# Altium schematic sheet 01-MCU.SchDoc
size A4
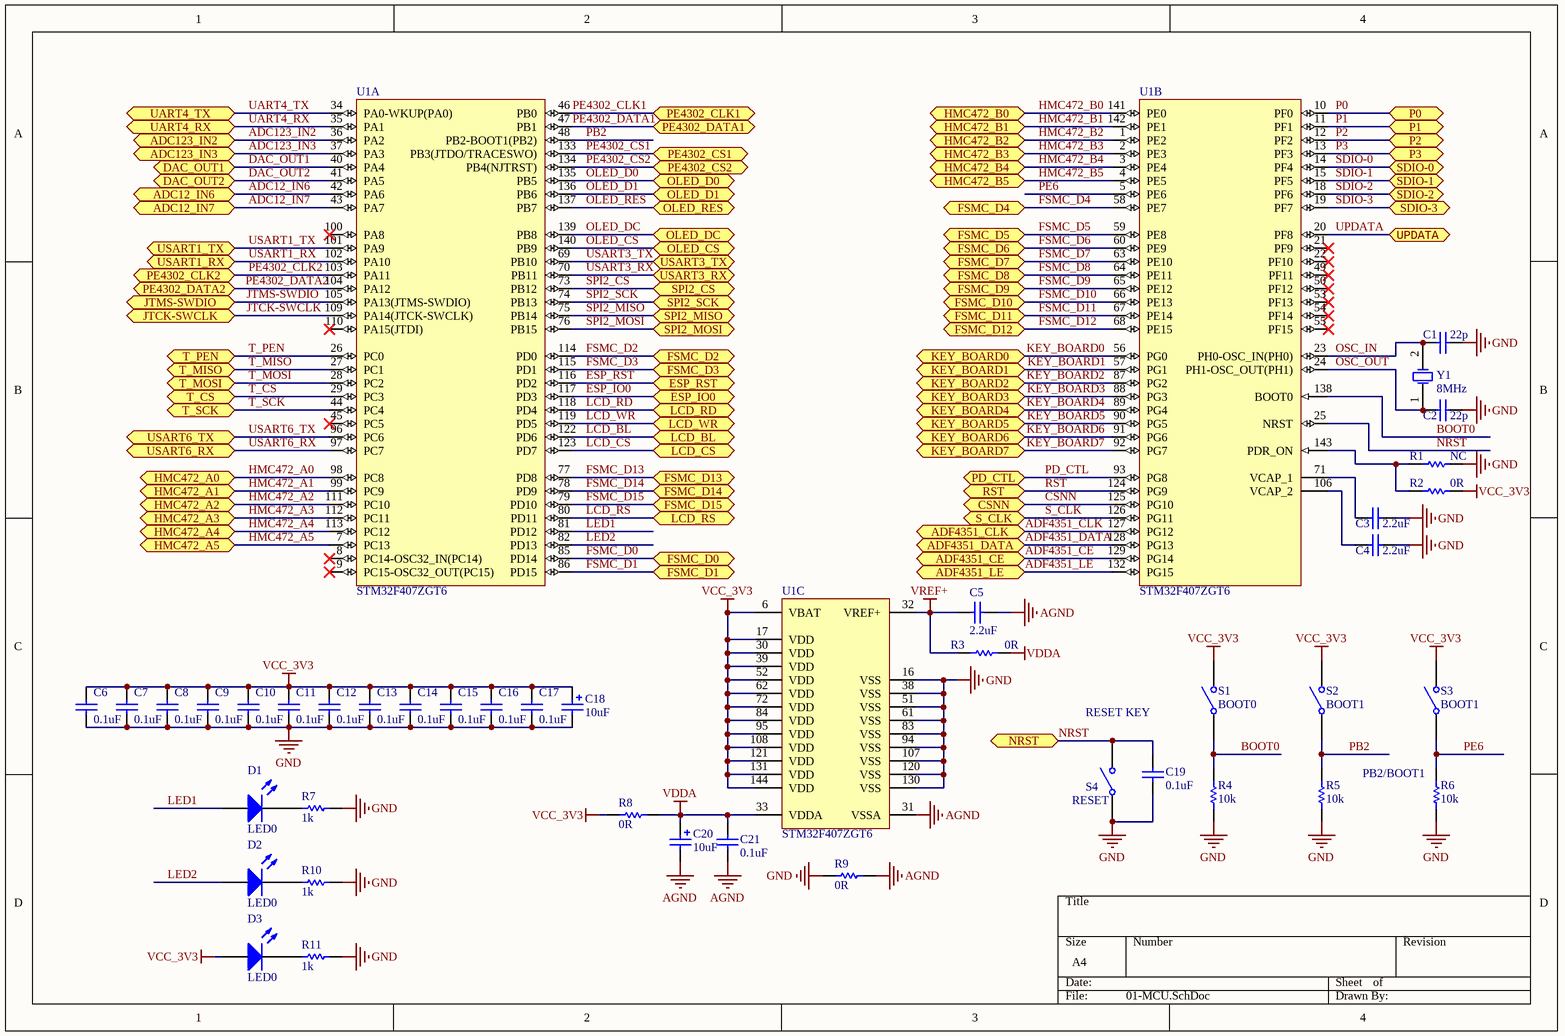
[diagram p0: 01-MCU.SchDoc]

## Parts
C1  22p  [0603C]
C2  22p  [0603C]
C3  2.2uF  [0603C]
C4  2.2uF  [0603C]
C5  2.2uF  [0603C]
C6  0.1uF  [0603C]
C7  0.1uF  [0603C]
C8  0.1uF  [0603C]
C9  0.1uF  [0603C]
C10  0.1uF  [0603C]
C11  0.1uF  [0603C]
C12  0.1uF  [0603C]
C13  0.1uF  [0603C]
C14  0.1uF  [0603C]
C15  0.1uF  [0603C]
C16  0.1uF  [0603C]
C17  0.1uF  [0603C]
C18  10uF  [1206T]
C19  0.1uF  [0603C]
C20  10uF  [1206T]
C21  0.1uF  [0603C]
D1  LED0  [0603D]
D2  LED0  [0603D]
D3  LED0  [0603D]
R1  NC  [0603R]
R2  0R  [0603R]
R3  0R  [0603R]
R4  10k  [0603R]
R5  10k  [0603R]
R6  10k  [0603R]
R7  1k  [0603R]
R8  0R  [0603R]
R9  0R  [0603R]
R10  1k  [0603R]
R11  1k  [0603R]
S1  BOOT0  [micro button_2_SMD]
S2  BOOT1  [micro button_2_SMD]
S3  BOOT1  [micro button_2_SMD]
S4  RESET  [micro button_2_SMD]
U1  STM32F407ZGT6  [QFP144-0r5-20X20]  (parts A,B,C of 3)
Y1  8MHz  [CO2-4R75X11R4-S]

## Ports
ADC12_IN6 (bidir), ADC12_IN7 (bidir), ADC123_IN2 (bidir), ADC123_IN3 (bidir), ADF4351_CE (bidir), ADF4351_CLK (bidir), ADF4351_DATA (bidir), ADF4351_LE (bidir), CSNN (bidir), DAC_OUT1 (bidir), DAC_OUT2 (bidir), ESP_IO0 (bidir), ESP_RST (bidir), FSMC_D0 (bidir), FSMC_D1 (bidir), FSMC_D2 (bidir), FSMC_D3 (bidir), FSMC_D4 (bidir), FSMC_D5 (bidir), FSMC_D6 (bidir), FSMC_D7 (bidir), FSMC_D8 (bidir), FSMC_D9 (bidir), FSMC_D10 (bidir), FSMC_D11 (bidir), FSMC_D12 (bidir), FSMC_D13 (bidir), FSMC_D14 (bidir), FSMC_D15 (bidir), HMC472_A0 (bidir), HMC472_A1 (bidir), HMC472_A2 (bidir), HMC472_A3 (bidir), HMC472_A4 (bidir), HMC472_A5 (bidir), HMC472_B0 (bidir), HMC472_B1 (bidir), HMC472_B2 (bidir), HMC472_B3 (bidir), HMC472_B4 (bidir), HMC472_B5 (bidir), JTCK-SWCLK (bidir), JTMS-SWDIO (bidir), KEY_BOARD0 (bidir), KEY_BOARD1 (bidir), KEY_BOARD2 (bidir), KEY_BOARD3 (bidir), KEY_BOARD4 (bidir), KEY_BOARD5 (bidir), KEY_BOARD6 (bidir), KEY_BOARD7 (bidir), LCD_BL (bidir), LCD_CS (bidir), LCD_RD (bidir), LCD_RS (bidir), LCD_WR (bidir), NRST (bidir), OLED_CS (bidir), OLED_D0 (bidir), OLED_D1 (bidir), OLED_DC (bidir), OLED_RES (bidir), P0 (bidir), P1 (bidir), P2 (bidir), P3 (bidir), PD_CTL (bidir), PE4302_CLK1 (bidir), PE4302_CLK2 (bidir), PE4302_CS1 (bidir), PE4302_CS2 (bidir), PE4302_DATA1 (bidir), PE4302_DATA2 (bidir), RST (bidir), S_CLK (bidir), SDIO-0 (bidir), SDIO-1 (bidir), SDIO-2 (bidir), SDIO-3 (bidir), SPI2_CS (bidir), SPI2_MISO (bidir), SPI2_MOSI (bidir), SPI2_SCK (bidir), T_CS (bidir), T_MISO (bidir), T_MOSI (bidir), T_PEN (bidir), T_SCK (bidir), UART4_RX (bidir), UART4_TX (bidir), UPDATA (bidir), USART1_RX (bidir), USART1_TX (bidir), USART3_RX (bidir), USART3_TX (bidir), USART6_RX (bidir), USART6_TX (bidir)

## Nets
AGND: C5.1 C20.2(-) C21.1 R9.1 U1.31(VSSA)
GND: C1.2 C2.2 C3.2 C4.2 C6.2 C7.2 C8.2 C9.2 C10.2 C11.2 C12.2 C13.2 C14.2 C15.2 C16.2 C17.2 C18.2(-) C19.1 R1.2 R4.1 R5.1 R6.1 R7.2 R9.2 R10.2 R11.2 S4.1(COMMON) U1.16(VSS) U1.38(VSS) U1.51(VSS) U1.61(VSS) U1.83(VSS) U1.94(VSS) U1.107(VSS) U1.120(VSS) U1.130(VSS)
VCC_3V3: C6.1 C7.1 C8.1 C9.1 C10.1 C11.1 C12.1 C13.1 C14.1 C15.1 C16.1 C17.1 C18.1(+) D3.1(A) R2.2 R8.2 S1.2(NO) S2.2(NO) S3.2(NO) U1.6(VBAT) U1.17(VDD) U1.30(VDD) U1.39(VDD) U1.52(VDD) U1.62(VDD) U1.72(VDD) U1.84(VDD) U1.95(VDD) U1.108(VDD) U1.121(VDD) U1.131(VDD) U1.144(VDD)
VDDA: C20.1(+) C21.2 R3.1 R8.1 U1.33(VDDA)
VREF+: C5.2 R3.2 U1.32(VREF+)
ADC12_IN6: U1.42(PA6) ; port ADC12_IN6
ADC12_IN7: U1.43(PA7) ; port ADC12_IN7
ADC123_IN2: U1.36(PA2) ; port ADC123_IN2
ADC123_IN3: U1.37(PA3) ; port ADC123_IN3
ADF4351_CE: U1.129(PG14) ; port ADF4351_CE
ADF4351_CLK: U1.127(PG12) ; port ADF4351_CLK
ADF4351_DATA: U1.128(PG13) ; port ADF4351_DATA
ADF4351_LE: U1.132(PG15) ; port ADF4351_LE
BOOT0: R4.2 S1.1(COMMON) U1.138(BOOT0)
CSNN: U1.125(PG10) ; port CSNN
DAC_OUT1: U1.40(PA4) ; port DAC_OUT1
DAC_OUT2: U1.41(PA5) ; port DAC_OUT2
ESP_IO0: U1.117(PD3) ; port ESP_IO0
ESP_RST: U1.116(PD2) ; port ESP_RST
FSMC_D0: U1.85(PD14) ; port FSMC_D0
FSMC_D1: U1.86(PD15) ; port FSMC_D1
FSMC_D2: U1.114(PD0) ; port FSMC_D2
FSMC_D3: U1.115(PD1) ; port FSMC_D3
FSMC_D4: U1.58(PE7) ; port FSMC_D4
FSMC_D5: U1.59(PE8) ; port FSMC_D5
FSMC_D6: U1.60(PE9) ; port FSMC_D6
FSMC_D7: U1.63(PE10) ; port FSMC_D7
FSMC_D8: U1.64(PE11) ; port FSMC_D8
FSMC_D9: U1.65(PE12) ; port FSMC_D9
FSMC_D10: U1.66(PE13) ; port FSMC_D10
FSMC_D11: U1.67(PE14) ; port FSMC_D11
FSMC_D12: U1.68(PE15) ; port FSMC_D12
FSMC_D13: U1.77(PD8) ; port FSMC_D13
FSMC_D14: U1.78(PD9) ; port FSMC_D14
FSMC_D15: U1.79(PD10) ; port FSMC_D15
HMC472_A0: U1.98(PC8) ; port HMC472_A0
HMC472_A1: U1.99(PC9) ; port HMC472_A1
HMC472_A2: U1.111(PC10) ; port HMC472_A2
HMC472_A3: U1.112(PC11) ; port HMC472_A3
HMC472_A4: U1.113(PC12) ; port HMC472_A4
HMC472_A5: U1.7(PC13) ; port HMC472_A5
HMC472_B0: U1.141(PE0) ; port HMC472_B0
HMC472_B1: U1.142(PE1) ; port HMC472_B1
HMC472_B2: U1.1(PE2) ; port HMC472_B2
HMC472_B3: U1.2(PE3) ; port HMC472_B3
HMC472_B4: U1.3(PE4) ; port HMC472_B4
HMC472_B5: U1.4(PE5) ; port HMC472_B5
JTCK-SWCLK: U1.109(PA14(JTCK-SWCLK)) ; port JTCK-SWCLK
JTMS-SWDIO: U1.105(PA13(JTMS-SWDIO)) ; port JTMS-SWDIO
KEY_BOARD0: U1.56(PG0) ; port KEY_BOARD0
KEY_BOARD1: U1.57(PG1) ; port KEY_BOARD1
KEY_BOARD2: U1.87(PG2) ; port KEY_BOARD2
KEY_BOARD3: U1.88(PG3) ; port KEY_BOARD3
KEY_BOARD4: U1.89(PG4) ; port KEY_BOARD4
KEY_BOARD5: U1.90(PG5) ; port KEY_BOARD5
KEY_BOARD6: U1.91(PG6) ; port KEY_BOARD6
KEY_BOARD7: U1.92(PG7) ; port KEY_BOARD7
LCD_BL: U1.122(PD6) ; port LCD_BL
LCD_CS: U1.123(PD7) ; port LCD_CS
LCD_RD: U1.118(PD4) ; port LCD_RD
LCD_RS: U1.80(PD11) ; port LCD_RS
LCD_WR: U1.119(PD5) ; port LCD_WR
LED1: D1.1(A) U1.81(PD12)
LED2: D2.1(A) U1.82(PD13)
NRST: C19.2 S4.2(NO) U1.25(NRST) ; port NRST
OLED_CS: U1.140(PB9) ; port OLED_CS
OLED_D0: U1.135(PB5) ; port OLED_D0
OLED_D1: U1.136(PB6) ; port OLED_D1
OLED_DC: U1.139(PB8) ; port OLED_DC
OLED_RES: U1.137(PB7) ; port OLED_RES
OSC_IN: C1.1 U1.23(PH0-OSC_IN(PH0)) Y1.2(OSC2)
OSC_OUT: C2.1 U1.24(PH1-OSC_OUT(PH1)) Y1.1(OSC1)
P0: U1.10(PF0) ; port P0
P1: U1.11(PF1) ; port P1
P2: U1.12(PF2) ; port P2
P3: U1.13(PF3) ; port P3
PB2: R5.2 S2.1(COMMON) U1.48(PB2-BOOT1(PB2))
PD_CTL: U1.93(PG8) ; port PD_CTL
PE6: R6.2 S3.1(COMMON) U1.5(PE6)
PE4302_CLK1: U1.46(PB0) ; port PE4302_CLK1
PE4302_CLK2: U1.103(PA11) ; port PE4302_CLK2
PE4302_CS1: U1.133(PB3(JTDO/TRACESWO)) ; port PE4302_CS1
PE4302_CS2: U1.134(PB4(NJTRST)) ; port PE4302_CS2
PE4302_DATA1: U1.47(PB1) ; port PE4302_DATA1
PE4302_DATA2: U1.104(PA12) ; port PE4302_DATA2
RST: U1.124(PG9) ; port RST
S_CLK: U1.126(PG11) ; port S_CLK
SDIO-0: U1.14(PF4) ; port SDIO-0
SDIO-1: U1.15(PF5) ; port SDIO-1
SDIO-2: U1.18(PF6) ; port SDIO-2
SDIO-3: U1.19(PF7) ; port SDIO-3
SPI2_CS: U1.73(PB12) ; port SPI2_CS
SPI2_MISO: U1.75(PB14) ; port SPI2_MISO
SPI2_MOSI: U1.76(PB15) ; port SPI2_MOSI
SPI2_SCK: U1.74(PB13) ; port SPI2_SCK
T_CS: U1.29(PC3) ; port T_CS
T_MISO: U1.27(PC1) ; port T_MISO
T_MOSI: U1.28(PC2) ; port T_MOSI
T_PEN: U1.26(PC0) ; port T_PEN
T_SCK: U1.44(PC4) ; port T_SCK
UART4_RX: U1.35(PA1) ; port UART4_RX
UART4_TX: U1.34(PA0-WKUP(PA0)) ; port UART4_TX
UPDATA: U1.20(PF8) ; port UPDATA
USART1_RX: U1.102(PA10) ; port USART1_RX
USART1_TX: U1.101(PA9) ; port USART1_TX
USART3_RX: U1.70(PB11) ; port USART3_RX
USART3_TX: U1.69(PB10) ; port USART3_TX
USART6_RX: U1.97(PC7) ; port USART6_RX
USART6_TX: U1.96(PC6) ; port USART6_TX
NetC3_1: C3.1 U1.71(VCAP_1)
NetC4_1: C4.1 U1.106(VCAP_2)
NetD1_2: D1.2(K) R7.1
NetD2_2: D2.2(K) R10.1
NetD3_2: D3.2(K) R11.1
NetR1_1: R1.1 R2.1 U1.143(PDR_ON)

Not connected (* = marked no-connect by the designer): U1 8(PC14-OSC32_IN(PC14))* 9(PC15-OSC32_OUT(PC15))* 21(PF9)* 22(PF10)* 45(PC5)* 49(PF11)* 50(PF12)* 53(PF13)* 54(PF14)* 55(PF15)* 100(PA8)* 110(PA15(JTDI))*

## Notes on the sheet
- RESET KEY
- (near R6) PB2/BOOT1

## Library data of the parts
C1-C17 C19 C21 = Cap1: CAP CER 10000PF 100V X7R 0603; Manufacturer: TDK Corporation; Manufacturer Part Number: C1608X7R2A103K080AA; Tolerance: ±10%; Notification: Current market demand for these product types have resulted in fluctuating and extending lead times. Lead times may differ.; Supplier 1: Digi-Key; RoHS: RoHS Compliant; Category: Capacitors; Stock 1: 40000; Pricing 1: 4000=0.01438 (USD); Packaging: Tape & Reel (TR); Part Status: Active; Voltage - Rated: 100V; Temperature Coefficient: X7R; Operating Temperature: -55°C ~ 125°C; Features: -; Ratings: -; Applications: General Purpose; Failure Rate: -; Mounting Type: Surface Mount, MLCC; Package / Case: 0603 (1608 Metric); Size / Dimension: 0.063" L x 0.032" W (1.60mm x 0.80mm); Height - Seated (Max): -; Thickness (Max): 0.035" (0.90mm); Lead Spacing: -; Lead Style: -; ComponentLink1URL: https://product.tdk.com/info/en/catalog/datasheets/mlcc_commercial_midvoltage_en.pdf; ComponentLink1Description: https://product.tdk.com/info/en/catalog/datasheets/mlcc_commercial_midvoltage_en.pdf; Supplier Part Number 1: 445-1304-2-ND
  C1 C2: Value: 22p
  C3-C5: Value: 2.2uF
  C6-C17 C19 C21: Value: 0.1uF
C18 C20 = Cap2: CAP TANT 10UF 10V 10% 1206; Manufacturer: KEMET; Manufacturer Part Number: T491A106K010AT7280; Manufacturer Size Code: A; Type: Molded; ESR (Equivalent Series Resistance): 3.8 Ohm; Lifetime @ Temp.: 2000 Hrs @ 125°C; Notification: Current market demand for these product types have resulted in fluctuating and extending lead times. Lead times may differ.; Supplier 1: Digi-Key; RoHS: RoHS Compliant; Category: Capacitors; Stock 1: 27000; Pricing 1: 9000=0.084, 18000=0.08138, 27000=0.07875, 63000=0.0735 (USD); Packaging: Tape & Reel (TR); Part Status: Active; Tolerance: ±10%; Operating Temperature: -55°C ~ 125°C; Mounting Type: Surface Mount; Package / Case: 1206 (3216 Metric); Size / Dimension: 0.126" L x 0.063" W (3.20mm x 1.60mm); Height - Seated (Max): 0.071" (1.80mm); Lead Spacing: -; Features: General Purpose; Failure Rate: -; ComponentLink1URL: https://api.kemet.com/component-edge/download/datasheet/T491A106K010AT7280.pdf; ComponentLink1Description: https://api.kemet.com/component-edge/download/datasheet/T491A106K010AT7280.pdf; Supplier Part Number 1: 399-8268-2-ND; Value: 10uF
D1-D3 = LED0: Typical INFRARED GaAs LED; pin to pad: 1>2 2>1; Published: 8-Jun-2000; LatestRevisionDate: 08-Jul-2005; LatestRevisionNote: Mech Layer 1 removed.; PackageReference: LED-0; Publisher: Altium Limited; PackageDescription: LED; 2 Leads
R1-R11 = Res1: RES SMD 1K OHM 0.5% 1/16W 0603; Manufacturer: Susumu; Manufacturer Part Number: RR0816P-102-D; Power (Watts): 0.063W, 1/16W; Temperature Coefficient: ±25ppm/°C; Supplier 1: Digi-Key; RoHS: RoHS Compliant; Category: Resistors; Stock 1: 1648842; Pricing 1: 1=0.13, 10=0.122, 100=0.0483, 1000=0.0225, 2500=0.01973 (USD); Packaging: Digi-Reel?; Part Status: Active; Tolerance: ±0.5%; Composition: Thin Film; Features: -; Operating Temperature: -55°C ~ 125°C; Package / Case: 0603 (1608 Metric); Supplier Device Package: -; Size / Dimension: 0.063" L x 0.032" W (1.60mm x 0.80mm); Height - Seated (Max): 0.020" (0.50mm); Failure Rate: -; ComponentLink1URL: http://www.susumu.co.jp/common/pdf/n_catalog_partition05_en.pdf; ComponentLink1Description: http://www.susumu.co.jp/common/pdf/n_catalog_partition05_en.pdf; Supplier Part Number 1: RR08P1.0KDDKR-ND
  R1: Value: NC
  R2 R3 R8 R9: Value: 0R
  R4-R6: Value: 10k
  R7 R10 R11: Value: 1k
S1-S4 = SW-SPST: Single-Pole, Single-Throw Switch; Published: 24-Mar-1999; LatestRevisionDate: 17-Jul-2002; LatestRevisionNote: Re-released for DXP Platform.; PackageReference: SPST-2; Publisher: Altium Limited; PackageDescription: Switch; 2 Leads
U1 = STM32F407ZGT6: ARM Cortex-M4 32-bit MCU+FPU, 210 DMIPS, 1024 kB Flash, 192 kB Internal RAM, 114 I/Os, 144-pin LQFP, -40 to 85 degC, Tray; Manufacturer: STMicroelectronics; D/A Converter: 2x12-bit; FLASH Size (Prog) (kB): 1024; I/Os (High Current): 114; Internal RAM Size (kB): 192; Operating Frequency(F) (Processor speed) (MHz): 168; Supply Voltage(Vcc) max (V): 3.6; Supply Voltage(Vcc) min (V): 1.8; DatasheetVersion: Rev. 4; PackageVersion: Rev. 4, 06/2013; PackageReference: LQFP144; PackageDescription: 144-Pin Low Profile Quad Flat Package, 20 x 20 mm Body, 0.5 mm Pitch; Supplier 1: Digi-Key; Supplier Part Number 1: 497-11766-ND; Supplier 2: Newark; Supplier Part Number 2: 73T2334; Supplier 3: Mouser; Supplier Part Number 3: 511-STM32F407ZGT6; Core: ARM Cortex-M4; Packing: Tray; Mounting Technology: Surface Mount; PartNumber: STM32F407ZGT6; ComponentLink1Description: Manufacturer URL; ComponentLink1URL: http://www.st.com/web/en/home.html; ComponentLink2Description: Datasheet; ComponentLink2URL: http://www.st.com/st-web-ui/static/active/en/resource/technical/document/datasheet/DM00037051.pdf; ComponentLink3Description: Package Specification; ComponentLink3URL: http://www.st.com/st-web-ui/static/active/en/resource/technical/document/datasheet/DM00037051.pdf
Y1 = XTAL: Crystal Oscillator; Published: 8-Jun-2000; LatestRevisionDate: 17-Jul-2002; LatestRevisionNote: Re-released for DXP Platform.; PackageReference: R38; Publisher: Altium Limited; PackageDescription: Crystal, Thru-Hole; 2 Leads; Body 3.1 x 8.2 mm (Dia.xH)